# Altium project Mako DSP.PrjPCB
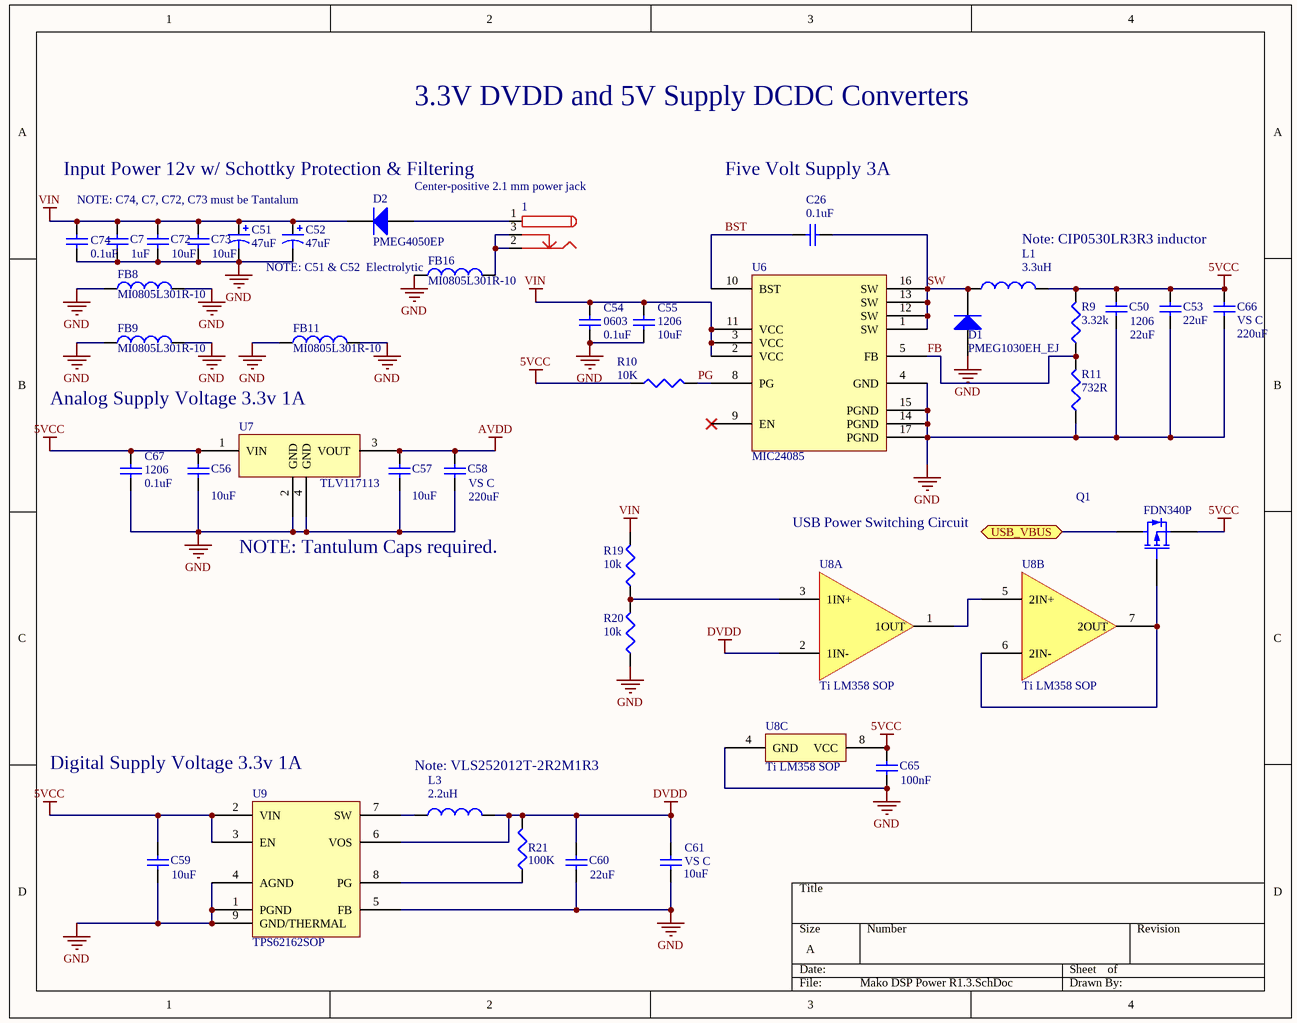
[diagram p0: Mako DSP Power R1.3.SchDoc]
4 sheets, 169 parts. Net scope: flat (ports and power ports of the same name join across sheets).
Board file: Mako DSP R1.6.PcbDoc
Sheets:
  Mako DSP Power R1.3.SchDoc
  Mako DSP Audio Codec R1.2.SchDoc
  Mako DSP Main R1.2.SchDoc
  Mako DSP USBR1.2.SchDoc

## Sheet Mako DSP Power R1.3.SchDoc
size A

### Parts
1  Center-positive 2.1 mm power jack  [PJ-102AH]
C7  value 1uF  [C1206]  (hidden comment: Cap Semi)
C26  value 0.1uF  [1608[0603]]  (hidden comment: Cap Semi)
C50  1206  value 22uF  [C1206]
C51  value 47uF  [CAPPR2.5-6.3x5]  (hidden comment: Cap Pol1)
C52  value 47uF  [CAPPR2.5-6.3x5]  (hidden comment: Cap Pol1)
C53  value 22uF  [C1206]  (hidden comment: Cap Semi)
C54  0603  value 0.1uF  [1608[0603]]
C55  1206  value 10uF  [C1206]
C56  value 10uF  [C1206]  (hidden comment: Cap Semi)
C57  value 10uF  [C1206]  (hidden comment: Cap Semi)
C58  VS C  value 220uF  [Panasonic VS C]
C59  value 10uF  [C1206]  (hidden comment: Cap Semi)
C60  value 22uF  [C1206]  (hidden comment: Cap Semi)
C61  VS C  value 10uF  [Panasonic VS C]
C65  value 100nF  [1608[0603]]  (hidden comment: Cap Semi)
C66  VS C  value 220uF  [Panasonic VS C]
C67  1206  value 0.1uF  [C1206]
C72  value 10uF  [C1206]  (hidden comment: Cap Semi)
C73  value 10uF  [C1206]  (hidden comment: Cap Semi)
C74  value 0.1uF  [C1206]  (hidden comment: Cap Semi)
D1  PMEG1030EH_EJ  [PMEG1030EH_EJ]
D2  PMEG4050EP  [PMEG4050EP]
FB8  MI0805L301R-10  [SM 0805 - gap trimmed]
FB9  MI0805L301R-10  [SM 0805 - gap trimmed]
FB11  MI0805L301R-10  [SM 0805 - gap trimmed]
FB16  MI0805L301R-10  [SM 0805 - gap trimmed]
L1  value 3.3uH  [CIP0530LR3R3]  (hidden comment: Inductor)
L3  value 2.2uH  [VLS252012T-2R2M1R3]  (hidden comment: Inductor)
Q1  FDN340P  [SOT23-3N]
R9  value 3.32k  [J1-0603]  (hidden comment: Res3)
R10  value 10K  [J1-0603]  (hidden comment: Res3)
R11  value 732R  [J1-0603]  (hidden comment: Res3)
R19  value 10k  [J1-0603]  (hidden comment: Res3)
R20  value 10k  [J1-0603]  (hidden comment: Res3)
R21  value 100K  [RESC2012L]  (hidden comment: Res3)
U6  MIC24085  [MIC24085-AYML]
U7  TLV117113  [TLV117112]
U8  Ti LM358 SOP  [LM358]  (parts A,B,C of 3)
U9  TPS62162SOP  [TPS62162SOP]

### Ports
USB_VBUS (bidir)

### Nets
5VCC: C50.2 C53.1 C56.1 C59.2 C65.1 C66.2 C67.2 L1.2 Q1.2(D) R9.2 R10.1 U7.1(VIN) U8.8(VCC) U9.2(VIN) U9.3(EN)
AVDD: C57.1 C58.1 U7.3(VOUT)
DVDD: C60.2 C61.1 L3.2 R21.2 U8.2(1IN-) U9.6(VOS)
GND: C7.1 C50.1 C51.2 C52.2 C53.2 C54.1 C55.1 C56.2 C57.2 C58.2 C59.1 C60.1 C61.2 C65.2 C66.1 C67.1 C72.1 C73.1 C74.1 D1.1(A) FB8.1 FB8.2 FB9.1 FB9.2 FB11.1 FB11.2 FB16.1 R11.1 R20.1 U6.4(GND) U6.14(PGND) U6.15(PGND) U6.17(PGND) U7.2(GND) U7.4(GND) U8.4(GND) U9.1(PGND) U9.4(AGND) U9.5(FB) U9.9(GND/THERMAL)
VIN: C7.2 C51.1 C52.1 C54.2 C55.2 C72.2 C73.2 C74.2 D2.1(A) R19.2 U6.2(VCC) U6.3(VCC) U6.11(VCC)
BST: C26.2 U6.10(BST)
FB: R9.1 R11.2 U6.5(FB)
PG: R10.2 U6.8(PG)
SW: C26.1 D1.2(K) L1.1 U6.1(SW) U6.12(SW) U6.13(SW) U6.16(SW)
Net1_1: 1.1 D2.2(K)
Net1_2: 1.2 1.3 FB16.2
NetFB7_2: Q1.3(S) ; port USB_VBUS
NetL3_1: L3.1 U9.7(SW)
NetQ1_1: Q1.1(G) U8.6(2IN-) U8.7(2OUT)
NetR19_1: R19.1 R20.2 U8.3(1IN+)
NetR21_1: R21.1 U9.8(PG)
NetU8_1: U8.1(1OUT) U8.5(2IN+)

Not connected (* = marked no-connect by the designer): U6 6(NC) 7(NC) 9(EN)*

### Notes on the sheet
- 3.3V DVDD and 5V Supply DCDC Converters
- Input Power 12v w/ Schottky Protection & Filtering
- NOTE: C74, C7, C72, C73 must be Tantalum
- Five Volt Supply 3A
- (near FB16) NOTE: C51 & C52  Electrolytic
- Note: CIP0530LR3R3 inductor
- Analog Supply Voltage 3.3v 1A
- NOTE: Tantulum Caps required.
- USB Power Switching Circuit
- (near U9) Digital Supply Voltage 3.3v 1A
- Note: VLS252012T-2R2M1R3

### Library data of the parts
1 = PWR2.5: Power jack; Published: 17-Dec-2003; DatasheetDocument: 09-May-2002; Publisher: Altium Limited; ComponentLink1Description: Manufacturer Link; ComponentLink1URL: http://domino.kycon.com/internet/Products.html
C7 C26 C50 C53-C61 C65-C67 C72-C74 = Cap Semi: Capacitor (Semiconductor SIM Model); Published: 8-Jun-2000; LatestRevisionDate: 29-May-2009; LatestRevisionNote: IPC-7351 Footprint Added.; PackageReference: C1206; Publisher: Altium Limited; PackageDescription: Chip Capacitor
C51 C52 = Cap Pol1: Polarized Capacitor (Radial); Published: 8-Jun-2000; LatestRevisionDate: 17-Jul-2002; LatestRevisionNote: Re-released for DXP Platform.; PackageReference: RB7.6-15; Publisher: Altium Limited; PackageDescription: Polarized Capacitor (Radial); 2 Leads
D1 D2 = Diode: Default Diode; Published: 8-Jun-2000; LatestRevisionDate: 17-Jul-2002; LatestRevisionNote: Re-released for DXP Platform.; PackageVersion: Sep-1996; PackageReference: SMC; Publisher: Altium Limited; PackageDescription: DO-214-AB/SMC; 2 C-Bend Leads; Body 7.9 x 5.9 mm, inc. leads (LxW); Code_JEDEC: DO-214-AB
FB8 FB9 FB11 FB16 L1 L3 = Inductor: Code_IEC: 1005; Published: 8-Jun-2000; PackageReference: 0402-A; Publisher: Altium Limited; Code_JEITA: 0402
  FB8 FB9 FB11 FB16: LatestRevisionDate: 17-Jul-2002; LatestRevisionNote: Re-released for DXP Platform.
  L1 L3: LatestRevisionDate: 29-May-2009; LatestRevisionNote: IPC-7351 Footprint Added.; PackageDescription: Chip Inductor
Q1 = FDN340P: P-Channel MOSFET; Published: 8-Jun-2000; LatestRevisionDate: 17-Jul-2002; LatestRevisionNote: Re-released for DXP Platform.; PackageVersion: 1995/1996; PackageReference: E3; Publisher: Altium Limited; PackageDescription: TO, Flat Index; 3 In-Line, Axial Leads; Body Dia. 4.6mm; Lead Dia. 0.5 mm (max)
R9-R11 R19-R21 = Res3: Resistor; Published: 8-Jun-2000; LatestRevisionDate: 29-May-2009; LatestRevisionNote: IPC-7351 Footprint Added.; PackageReference: J1-0603; Publisher: Altium Limited; PackageDescription: Chip Resistor
U7 = TLV117112: Linear Regulator
U8 = LM358_Symbol

## Sheet Mako DSP Audio Codec R1.2.SchDoc
size B
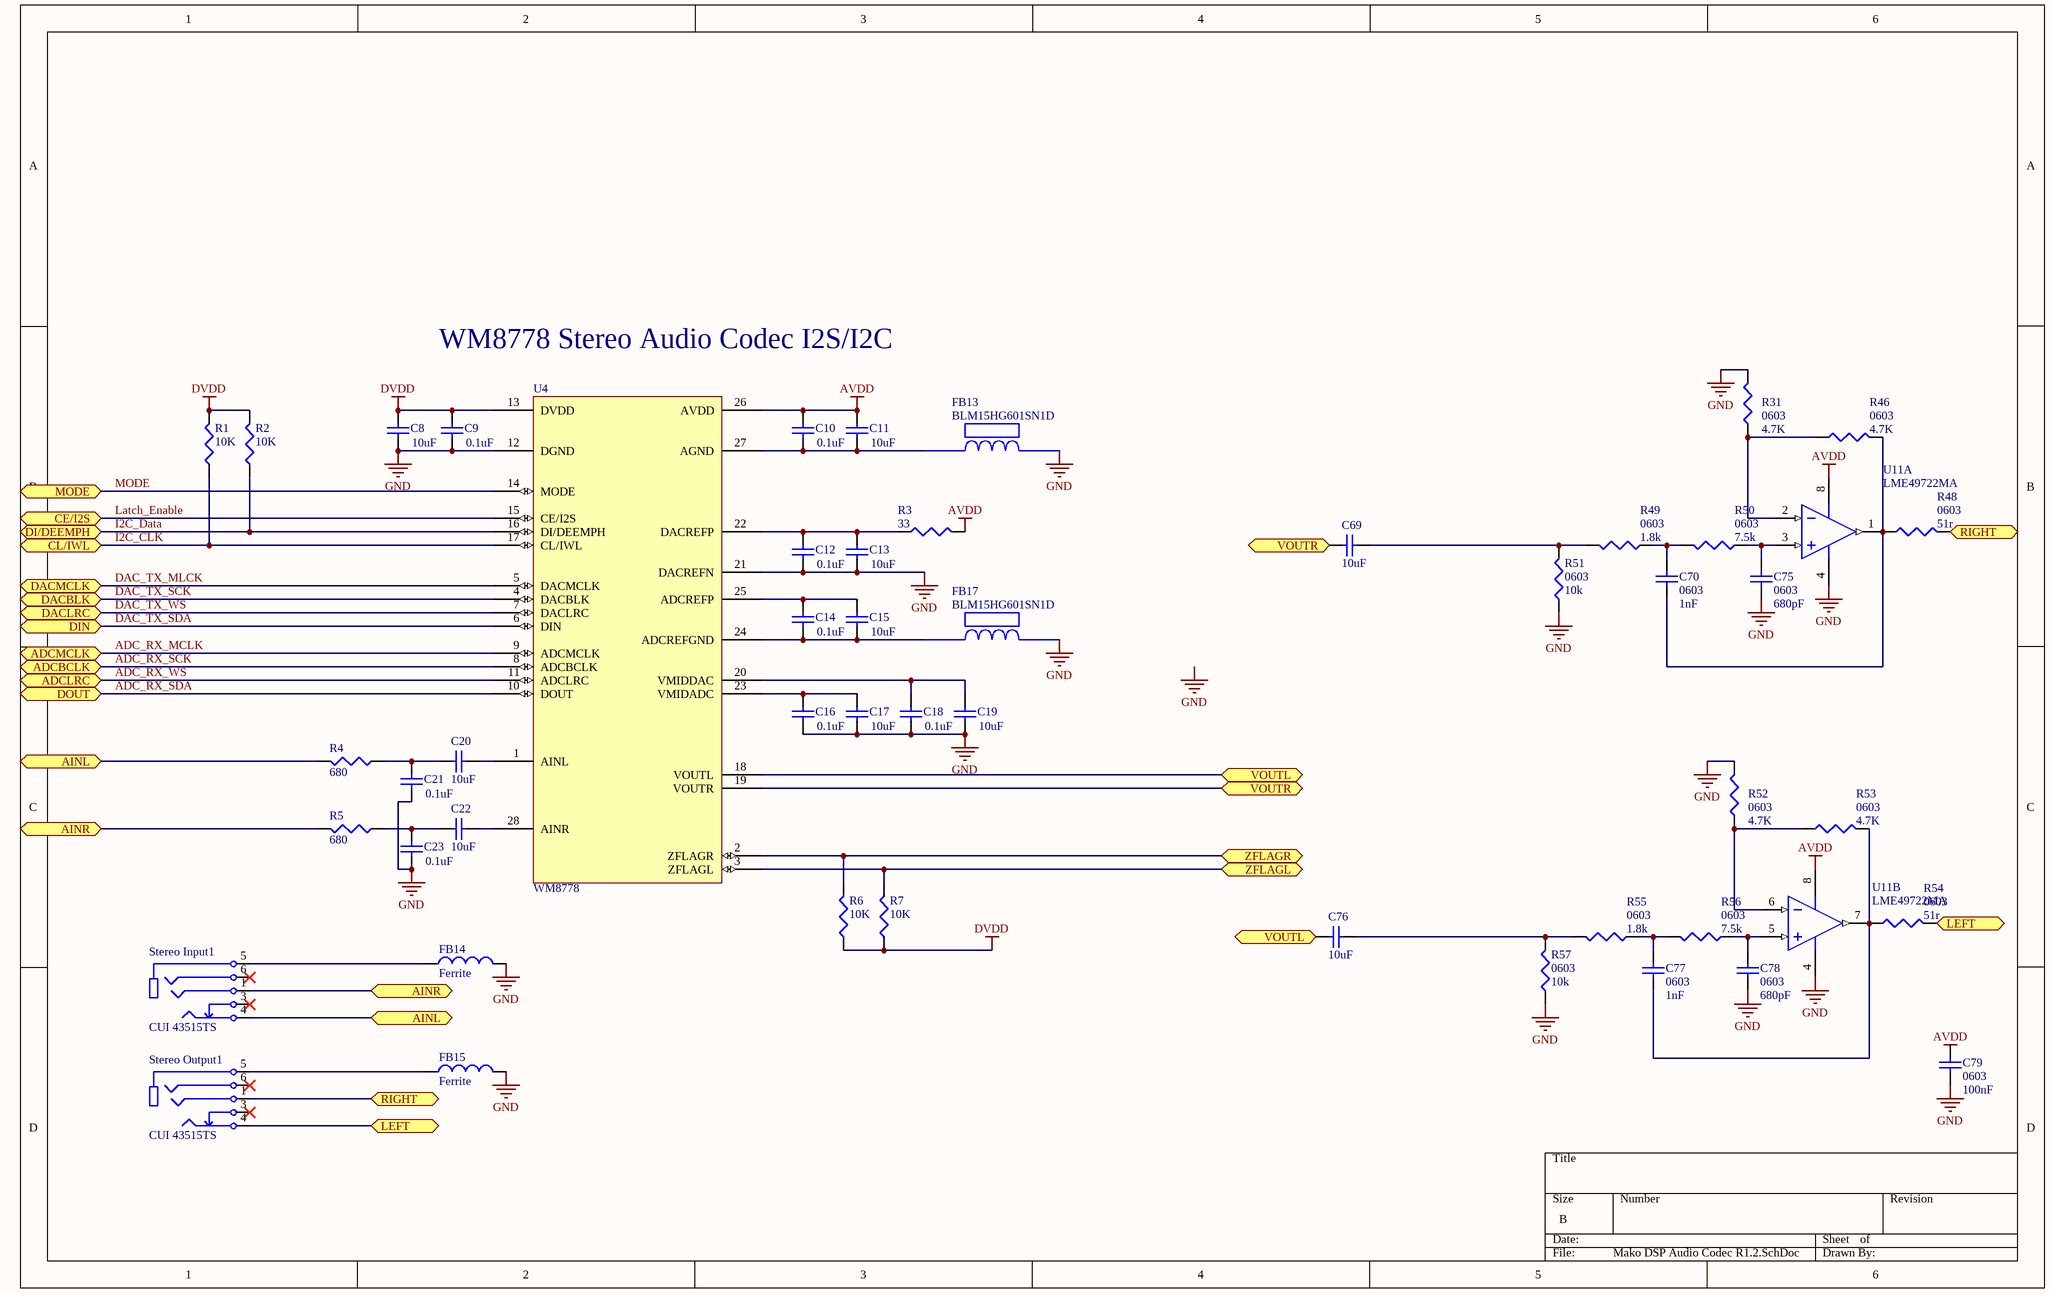
[diagram p1: Mako DSP Audio Codec R1.2.SchDoc]

### Parts
C8  value 10uF  [1608[0603]]  (hidden comment: Cap Semi)
C9  value 0.1uF  [1608[0603]]  (hidden comment: Cap Semi)
C10  value 0.1uF  [1608[0603]]  (hidden comment: Cap Semi)
C11  value 10uF  [1608[0603]]  (hidden comment: Cap Semi)
C12  value 0.1uF  [1608[0603]]  (hidden comment: Cap Semi)
C13  value 10uF  [1608[0603]]  (hidden comment: Cap Semi)
C14  value 0.1uF  [1608[0603]]  (hidden comment: Cap Semi)
C15  value 10uF  [1608[0603]]  (hidden comment: Cap Semi)
C16  value 0.1uF  [1608[0603]]  (hidden comment: Cap Semi)
C17  value 10uF  [1608[0603]]  (hidden comment: Cap Semi)
C18  value 0.1uF  [1608[0603]]  (hidden comment: Cap Semi)
C19  value 10uF  [1608[0603]]  (hidden comment: Cap Semi)
C20  value 10uF  [Panasonic VS B]  (hidden comment: Cap Semi)
C21  value 0.1uF  [SM 0805 - gap trimmed]  (hidden comment: Cap Semi)
C22  value 10uF  [Panasonic VS B]  (hidden comment: Cap Semi)
C23  value 0.1uF  [SM 0805 - gap trimmed]  (hidden comment: Cap Semi)
C69  value 10uF  [Panasonic VS B]  (hidden comment: Cap Semi)
C70  0603  value 1nF  [1608[0603]]
C75  0603  value 680pF  [1608[0603]]
C76  value 10uF  [Panasonic VS B]  (hidden comment: Cap Semi)
C77  0603  value 1nF  [1608[0603]]
C78  0603  value 680pF  [1608[0603]]
C79  0603  value 100nF  [1608[0603]]
FB13  BLM15HG601SN1D  [BLM18PG121SN1D]
FB14  Ferrite  [SM 0805 - gap trimmed]
FB15  Ferrite  [SM 0805 - gap trimmed]
FB17  BLM15HG601SN1D  [BLM18PG121SN1D]
R1  value 10K  [J1-0603]  (hidden comment: Res3)
R2  value 10K  [J1-0603]  (hidden comment: Res3)
R3  value 33  [J1-0603]  (hidden comment: Res3)
R4  value 680  [SM 0805 - gap trimmed]  (hidden comment: Res3)
R5  value 680  [SM 0805 - gap trimmed]  (hidden comment: Res3)
R6  value 10K  [J1-0603]  (hidden comment: Res3)
R7  value 10K  [J1-0603]  (hidden comment: Res3)
R31  0603  value 4.7K  [J1-0603]
R46  0603  value 4.7K  [J1-0603]
R48  0603  value 51r  [J1-0603]
R49  0603  value 1.8k  [J1-0603]
R50  0603  value 7.5k  [J1-0603]
R51  0603  value 10k  [J1-0603]
R52  0603  value 4.7K  [J1-0603]
R53  0603  value 4.7K  [J1-0603]
R54  0603  value 51r  [J1-0603]
R55  0603  value 1.8k  [J1-0603]
R56  0603  value 7.5k  [J1-0603]
R57  0603  value 10k  [J1-0603]
Stereo_Input1  CUI 43515TS  [CUI SJ-43515TS]
Stereo_Output1  CUI 43515TS  [CUI SJ-43515TS]
U4  WM8778  [WM8778]
U11  LME49722MA  [M08A_N]  (parts A,B of 2)

### Ports
ADCBCLK (bidir), ADCLRC (bidir), ADCMCLK (bidir), AINL, AINR, CE/I2S (bidir), CL/IWL (bidir), DACBLK (bidir), DACLRC (bidir), DACMCLK (bidir), DI/DEEMPH (bidir), DIN (bidir), DOUT (bidir), LEFT, MODE (bidir), RIGHT, VOUTL, VOUTR, ZFLAGL (bidir), ZFLAGR (bidir)

### Nets
AVDD: C10.2 C11.2 R3.2 U4.26(AVDD) U11.8(V+)
DVDD: C8.2 C9.2 R1.2 R2.2 R6.1 R7.1 U4.13(DVDD)
GND: C8.1 C9.1 C12.1 C13.1 C16.1 C17.1 C18.1 C19.1 C21.1 C23.1 C75.1 C78.1 C79.1 FB13.2 FB14.2 FB15.2 FB17.2 R31.2 R51.1 R52.2 R57.1 U4.12(DGND) U4.21(DACREFN) U11.4(V-)
ADC_RX_MCLK: U4.9(ADCMCLK) ; port ADCMCLK
ADC_RX_SCK: U4.8(ADCBCLK) ; port ADCBCLK
ADC_RX_SDA: U4.10(DOUT) ; port DOUT
ADC_RX_WS: U4.11(ADCLRC) ; port ADCLRC
DAC_TX_MLCK: U4.5(DACMCLK) ; port DACMCLK
DAC_TX_SCK: U4.4(DACBLK) ; port DACBLK
DAC_TX_SDA: U4.6(DIN) ; port DIN
DAC_TX_WS: U4.7(DACLRC) ; port DACLRC
I2C_CLK: R1.1 U4.17(CL/IWL) ; port CL/IWL
I2C_Data: R2.1 U4.16(DI/DEEMPH) ; port DI/DEEMPH
Latch_Enable: U4.15(CE/I2S) ; port CE/I2S
MODE: U4.14(MODE) ; port MODE
NetC10_1: C10.1 C11.1 FB13.1 U4.27(AGND)
NetC12_2: C12.2 C13.2 R3.1 U4.22(DACREFP)
NetC14_1: C14.1 C15.1 FB17.1 U4.24(ADCREFGND)
NetC14_2: C14.2 C15.2 U4.25(ADCREFP)
NetC16_2: C16.2 C17.2 U4.23(VMIDADC)
NetC18_2: C18.2 C19.2 U4.20(VMIDDAC)
NetC20_1: C20.1 U4.1(AINL)
NetC20_2: C20.2 C21.2 R4.1
NetC22_1: C22.1 U4.28(AINR)
NetC22_2: C22.2 C23.2 R5.1
NetC69_1: C69.1 U4.19(VOUTR) ; port VOUTR
NetC69_2: C69.2 R49.2 R51.2
NetC70_1: C70.1 R46.2 R48.1 U11.1(OUT_A)
NetC70_2: C70.2 R49.1 R50.2
NetC75_2: C75.2 R50.1 U11.3(IN_A)
NetC76_1: C76.1 U4.18(VOUTL) ; port VOUTL
NetC76_2: C76.2 R55.2 R57.2
NetC77_1: C77.1 R53.2 R54.1 U11.7(OUT_B)
NetC77_2: C77.2 R55.1 R56.2
NetC78_2: C78.2 R56.1 U11.5(IN_B)
NetFB14_1: FB14.1 Stereo_Input1.5(SLEEVE)
NetFB15_1: FB15.1 Stereo_Output1.5(SLEEVE)
NetR4_2: R4.2 Stereo_Input1.4(TIP) ; port AINL
NetR5_2: R5.2 Stereo_Input1.1(R1) ; port AINR
NetR6_2: R6.2 U4.2(ZFLAGR) ; port ZFLAGR
NetR7_2: R7.2 U4.3(ZFLAGL) ; port ZFLAGL
NetR31_1: R31.1 R46.1 U11.2(IN_A)
NetR48_2: R48.2 Stereo_Output1.1(R1) ; port RIGHT
NetR52_1: R52.1 R53.1 U11.6(IN_B)
NetR54_2: R54.2 Stereo_Output1.4(TIP) ; port LEFT

Not connected (* = marked no-connect by the designer): C79 2; Stereo_Input1 3(TS)* 6(R2)*; Stereo_Output1 3(TS)* 6(R2)*

### Notes on the sheet
- WM8778 Stereo Audio Codec I2S/I2C
- Labels drawn without touching a wire or pin: AVDD, GND

### Library data of the parts
C8-C23 C69 C70 C75-C79 = Cap Semi: Capacitor (Semiconductor SIM Model); Published: 8-Jun-2000; LatestRevisionDate: 29-May-2009; LatestRevisionNote: IPC-7351 Footprint Added.; PackageReference: C1206; Publisher: Altium Limited; PackageDescription: Chip Capacitor
FB14 FB15 = Inductor: Code_IEC: 1005; Published: 8-Jun-2000; LatestRevisionDate: 17-Jul-2002; LatestRevisionNote: Re-released for DXP Platform.; PackageReference: 0402-A; Publisher: Altium Limited; Code_JEITA: 0402
R1-R7 R31 R46 R48-R57 = Res3: Resistor; Published: 8-Jun-2000; LatestRevisionDate: 29-May-2009; LatestRevisionNote: IPC-7351 Footprint Added.; PackageReference: J1-0603; Publisher: Altium Limited; PackageDescription: Chip Resistor
U11 = LME49722MA: Low Noise, High Performance, High Fidelity Dual Audio Operational Amplifier, 8-pin Narrow SOIC; Manufacturer: National Semiconductor; PackageTopMarking: NSZXTT*L49722*MA; PowerWise: N; CompType: Audio IC; High-Reliability: Y; DatasheetVersion: Mar-2008; PackageVersion: revM, May-2009; PackageReference: M08A; PackageDescription: SOIC Narrow, 4.9 x 3.9 x 1.45mm, 8 Lead, 1.27mm Pitch; PartNumber: LME49722MA; RoHS: Y; PinCount: 8; Code_JEDEC: MS-012-AA; Code_IPC: SOIC127P600-8; ComponentLink1Description: Manufacturer URL; ComponentLink1URL: http://www.national.com/; ComponentLink2Description: LME49722 Datasheet; ComponentLink2URL: http://www.national.com/ds/LM/LME49722.pdf; ComponentLink3Description: LME49722 Web Page; ComponentLink3URL: http://www.national.com/pf/LM/LME49722.html; ComponentLink4Description: M08A Package Page; ComponentLink4URL: http://www.national.com/packaging/folders/m08a.html

## Sheet Mako DSP Main R1.2.SchDoc
size B
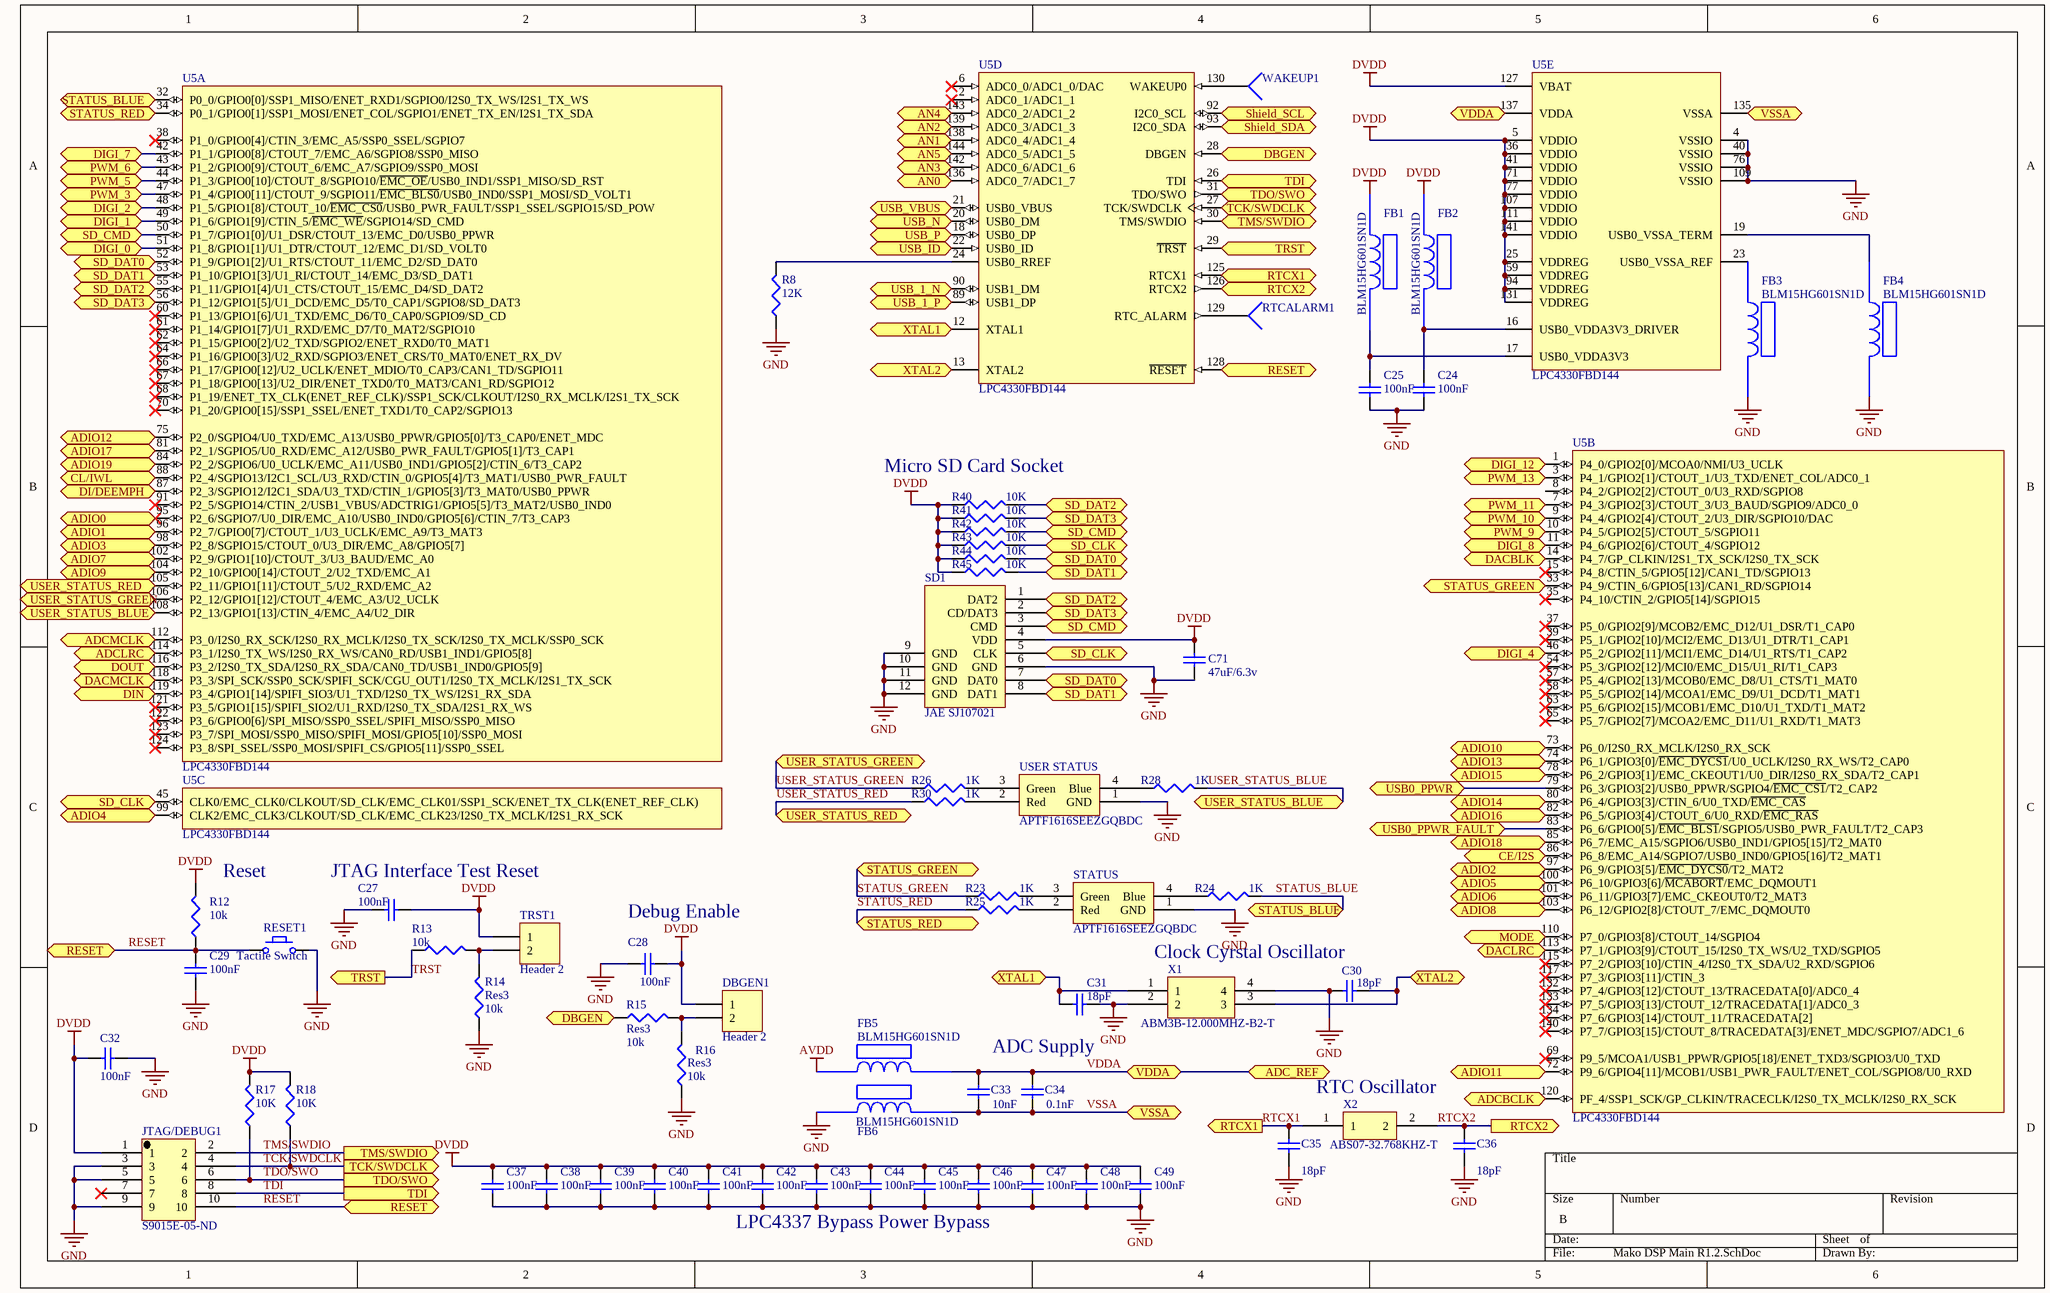
[diagram p2: Mako DSP Main R1.2.SchDoc]

### Parts
C24  value 100nF  [0402]  (hidden comment: Cap Semi)
C25  value 100nF  [0402]  (hidden comment: Cap Semi)
C27  C1: 100nF  [CAPC1608L]  (hidden comment: Cap Semi)
C28  C1: 100nF  [CAPC1608L]  (hidden comment: Cap Semi)
C29  C1: 100nF  [CAPC1608L]  (hidden comment: Cap Semi)
C30  value 18pF  [1608[0603]]  (hidden comment: Cap Semi)
C31  value 18pF  [1608[0603]]  (hidden comment: Cap Semi)
C32  C1: 100nF  [CAPC1608L]  (hidden comment: Cap Semi)
C33  value 10nF  [1608[0603]]  (hidden comment: Cap Semi)
C34  value 0.1nF  [1608[0603]]  (hidden comment: Cap Semi)
C35  value 18pF  [1608[0603]]  (hidden comment: Cap Semi)
C36  value 18pF  [1608[0603]]  (hidden comment: Cap Semi)
C37  value 100nF  [1608[0603]]  (hidden comment: Cap Semi)
C38  value 100nF  [1608[0603]]  (hidden comment: Cap Semi)
C39  value 100nF  [1608[0603]]  (hidden comment: Cap Semi)
C40  value 100nF  [1608[0603]]  (hidden comment: Cap Semi)
C41  value 100nF  [1608[0603]]  (hidden comment: Cap Semi)
C42  value 100nF  [1608[0603]]  (hidden comment: Cap Semi)
C43  value 100nF  [1608[0603]]  (hidden comment: Cap Semi)
C44  value 100nF  [1608[0603]]  (hidden comment: Cap Semi)
C45  value 100nF  [1608[0603]]  (hidden comment: Cap Semi)
C46  value 100nF  [1608[0603]]  (hidden comment: Cap Semi)
C47  value 100nF  [1608[0603]]  (hidden comment: Cap Semi)
C48  value 100nF  [1608[0603]]  (hidden comment: Cap Semi)
C49  value 100nF  [1608[0603]]  (hidden comment: Cap Semi)
C71  value 47uF/6.3v  [Panasonic VS B]  (hidden comment: Cap Semi)
DBGEN1  Header 2  [HDR1X2]
FB1  BLM15HG601SN1D  [BLM18PG121SN1D]
FB2  BLM15HG601SN1D  [BLM18PG121SN1D]
FB3  BLM15HG601SN1D  [BLM18PG121SN1D]
FB4  BLM15HG601SN1D  [BLM18PG121SN1D]
FB5  BLM15HG601SN1D  [BLM18PG121SN1D]
FB6  BLM15HG601SN1D  [BLM18PG121SN1D]
JTAG/DEBUG1  S9015E-05-ND  [S9015E-05-ND]
R8  value 12K  [J1-0603]  (hidden comment: Res3)
R12  value 10k  [J1-0603]  (hidden comment: Res3)
R13  value 10k  [J1-0603]  (hidden comment: Res3)
R14  Res3  value 10k  [J1-0603]
R15  Res3  value 10k  [J1-0603]
R16  Res3  value 10k  [J1-0603]
R17  value 10K  [J1-0603]  (hidden comment: Res3)
R18  value 10K  [J1-0603]  (hidden comment: Res3)
R23  value 1K  [J1-0603]  (hidden comment: Res3)
R24  value 1K  [J1-0603]  (hidden comment: Res3)
R25  value 1K  [J1-0603]  (hidden comment: Res3)
R26  value 1K  [J1-0603]  (hidden comment: Res3)
R28  value 1K  [J1-0603]  (hidden comment: Res3)
R30  value 1K  [J1-0603]  (hidden comment: Res3)
R40  value 10K  [J1-0603]  (hidden comment: Res3)
R41  value 10K  [J1-0603]  (hidden comment: Res3)
R42  value 10K  [J1-0603]  (hidden comment: Res3)
R43  value 10K  [J1-0603]  (hidden comment: Res3)
R44  value 10K  [J1-0603]  (hidden comment: Res3)
R45  value 10K  [J1-0603]  (hidden comment: Res3)
RESET1  Tactile Switch  [TL3301]
RTCALARM1  Socket  [PIN1]  (value not drawn)
SD1  JAE SJ107021  [JAE SJ107021]
STATUS  APTF1616SEEZGQBDC  [RGB LED APTF1616SEEZGQBDC]
TRST1  Header 2  [HDR1X2]
U5  LPC4330FBD144  [SOT486-1_V]  (parts A,B,C,D,E of 5)
USER_STATUS  APTF1616SEEZGQBDC  [RGB LED APTF1616SEEZGQBDC]
WAKEUP1  Socket  [PIN1]  (value not drawn)
X1  ABM3B-12.000MHZ-B2-T  [ABM3B-12.000MHZ-B2-T]
X2  ABS07-32.768KHZ-T  [ABS07-32.768KHZ-T]

### Ports
ADC_REF, ADCBCLK (bidir), ADCLRC (bidir), ADCMCLK (bidir), ADIO0 (bidir), ADIO1 (bidir), ADIO2 (bidir), ADIO3 (bidir), ADIO4, ADIO5 (bidir), ADIO6 (bidir), ADIO7, ADIO8 (bidir), ADIO9, ADIO10 (bidir), ADIO11 (bidir), ADIO12 (bidir), ADIO13 (bidir), ADIO14 (bidir), ADIO15 (bidir), ADIO16 (bidir), ADIO17 (bidir), ADIO18 (bidir), ADIO19 (bidir), AN0 (bidir), AN1 (bidir), AN2 (bidir), AN3 (bidir), AN4 (bidir), AN5 (bidir), CE/I2S (bidir), CL/IWL (bidir), DACBLK (bidir), DACLRC (bidir), DACMCLK (bidir), DBGEN (in), DBGEN (out), DI/DEEMPH (bidir), DIGI_0 (bidir), DIGI_1 (bidir), DIGI_2 (bidir), DIGI_4 (bidir), DIGI_7 (bidir), DIGI_8 (bidir), DIGI_12 (bidir), DIN (bidir), DOUT (bidir), MODE (bidir), PWM_3 (bidir), PWM_5 (bidir), PWM_6 (bidir), PWM_9 (bidir), PWM_10 (bidir), PWM_11 (bidir), PWM_13 (bidir), RESET (bidir), RTCX1 (in), RTCX1 (out), RTCX2 (out), SD_CLK (bidir), SD_CMD (bidir), SD_DAT0 (bidir), SD_DAT1 (bidir), SD_DAT2 (bidir), SD_DAT3 (bidir), Shield_SCL (bidir), Shield_SDA (bidir), STATUS_BLUE (bidir), STATUS_GREEN (bidir), STATUS_RED (bidir), TCK/SWDCLK (in), TCK/SWDCLK (out), TDI (in), TDI (out), TDO/SWO (out), TMS/SWDIO (in), TMS/SWDIO (out), TRST (in), TRST (out), USB0_PPWR (bidir), USB0_PPWR_FAULT (bidir), USB_1_N (bidir), USB_1_P (bidir), USB_ID (bidir), USB_N (bidir), USB_P (bidir), USB_VBUS (bidir), USER_STATUS_BLUE (bidir), USER_STATUS_GREEN (bidir), USER_STATUS_RED (bidir), VDDA, VSSA, XTAL1 (bidir), XTAL2 (bidir)

### Nets
AVDD: FB5.1
DVDD: C27.2 C28.2 C32.1 C37.2 C38.2 C39.2 C40.2 C41.2 C42.2 C43.2 C44.2 C45.2 C46.2 C47.2 C48.2 C49.2 C71.2 DBGEN1.1 FB1.1 FB2.1 JTAG/DEBUG1.1 R12.2 R17.2 R18.2 R40.1 R41.1 R42.1 R43.1 R44.1 R45.1 SD1.4(VDD) TRST1.1 U5.5(VDDIO) U5.25(VDDREG) U5.36(VDDIO) U5.41(VDDIO) U5.59(VDDREG) U5.71(VDDIO) U5.77(VDDIO) U5.94(VDDREG) U5.107(VDDIO) U5.111(VDDIO) U5.127(VBAT) U5.131(VDDREG) U5.141(VDDIO)
GND: C24.1 C25.1 C27.1 C28.1 C29.1 C30.2 C31.1 C32.2 C35.1 C36.1 C37.1 C38.1 C39.1 C40.1 C41.1 C42.1 C43.1 C44.1 C45.1 C46.1 C47.1 C48.1 C49.1 C71.1 FB3.2 FB4.2 FB6.1 JTAG/DEBUG1.3 JTAG/DEBUG1.5 JTAG/DEBUG1.9 R8.1 R14.1 R16.1 RESET1.2 SD1.6(GND) SD1.9(GND) SD1.10(GND) SD1.11(GND) SD1.12(GND) STATUS.1(GND) U5.4(VSSIO) U5.40(VSSIO) U5.76(VSSIO) U5.109(VSSIO) USER_STATUS.1(GND) X1.2 X1.4
ADC_RX_MCLK: U5.112(P3_0/I2S0_RX_SCK/I2S0_RX_MCLK/I2S0_TX_SCK/I2S0_TX_MCLK/SSP0_SCK) ; port ADCMCLK
ADC_RX_SCK: U5.120(PF_4/SSP1_SCK/GP_CLKIN/TRACECLK/I2S0_TX_MCLK/I2S0_RX_SCK) ; port ADCBCLK
ADC_RX_SDA: U5.116(P3_2/I2S0_TX_SDA/I2S0_RX_SDA/CAN0_TD/USB1_IND0/GPIO5[9]) ; port DOUT
ADC_RX_WS: U5.114(P3_1/I2S0_TX_WS/I2S0_RX_WS/CAN0_RD/USB1_IND1/GPIO5[8]) ; port ADCLRC
DAC_TX_MLCK: U5.118(P3_3/SPI_SCK/SSP0_SCK/SPIFI_SCK/CGU_OUT1/I2S0_TX_MCLK/I2S1_TX_SCK) ; port DACMCLK
DAC_TX_SCK: U5.14(P4_7/GP_CLKIN/I2S1_TX_SCK/I2S0_TX_SCK) ; port DACBLK
DAC_TX_SDA: U5.119(P3_4/GPIO1[14]/SPIFI_SIO3/U1_TXD/I2S0_TX_WS/I2S1_RX_SDA) ; port DIN
DAC_TX_WS: U5.113(P7_1/GPIO3[9]/CTOUT_15/I2S0_TX_WS/U2_TXD/SGPIO5) ; port DACLRC
I2C_CLK: U5.88(P2_4/SGPIO13/I2C1_SCL/U3_RXD/CTIN_0/GPIO5[4]/T3_MAT1/USB0_PWR_FAULT) ; port CL/IWL
I2C_Data: U5.87(P2_3/SGPIO12/I2C1_SDA/U3_TXD/CTIN_1/GPIO5[3]/T3_MAT0/USB0_PPWR) ; port DI/DEEMPH
Latch_Enable: U5.86(P6_8/EMC_A14/SGPIO7/USB0_IND0/GPIO5[16]/T2_MAT1) ; port CE/I2S
MODE: U5.110(P7_0/GPIO3[8]/CTOUT_14/SGPIO4) ; port MODE
RESET: C29.2 JTAG/DEBUG1.10 R12.1 RESET1.1 U5.128(~{RESET}) ; port RESET
RTCX1: C35.2 U5.125(RTCX1) X2.1 ; port RTCX1
RTCX2: C36.2 U5.126(RTCX2) X2.2 ; port RTCX2
STATUS_BLUE: R24.2 U5.32(P0_0/GPIO0[0]/SSP1_MISO/ENET_RXD1/SGPIO0/I2S0_TX_WS/I2S1_TX_WS) ; port STATUS_BLUE
STATUS_GREEN: R23.1 U5.33(P4_9/CTIN_6/GPIO5[13]/CAN1_RD/SGPIO14) ; port STATUS_GREEN
STATUS_RED: R25.1 U5.34(P0_1/GPIO0[1]/SSP1_MOSI/ENET_COL/SGPIO1/ENET_TX_EN/I2S1_TX_SDA) ; port STATUS_RED
TCK/SWDCLK: JTAG/DEBUG1.4 R18.1 U5.27(TCK/SWDCLK) ; port TCK/SWDCLK
TDI: JTAG/DEBUG1.8 U5.26(TDI) ; port TDI
TDO/SWO: JTAG/DEBUG1.6 R17.1 U5.31(TDO/SWO) ; port TDO/SWO
TMS/SWDIO: JTAG/DEBUG1.2 U5.30(TMS/SWDIO) ; port TMS/SWDIO
TRST: R13.1 U5.29(~{TRST}) ; port TRST
USB0_N: U5.20(USB0_DM) ; port USB_N
USB0_P: U5.18(USB0_DP) ; port USB_P
USB0_PPWR: U5.79(P6_3/GPIO3[2]/USB0_PPWR/SGPIO4/~{EMC_CS1}/T2_CAP2) ; port USB0_PPWR
USB0_PPWR_FAULT: U5.83(P6_6/GPIO0[5]/~{EMC_BLS1}/SGPIO5/USB0_PWR_FAULT/T2_CAP3) ; port USB0_PPWR_FAULT
USER_STATUS_BLUE: R28.2 U5.108(P2_13/GPIO1[13]/CTIN_4/EMC_A4/U2_DIR) ; port USER_STATUS_BLUE
USER_STATUS_GREEN: R26.1 U5.106(P2_12/GPIO1[12]/CTOUT_4/EMC_A3/U2_UCLK) ; port USER_STATUS_GREEN
USER_STATUS_RED: R30.1 U5.105(P2_11/GPIO1[11]/CTOUT_5/U2_RXD/EMC_A2) ; port USER_STATUS_RED
VDDA: C33.2 C34.2 FB5.2 U5.137(VDDA) ; port VDDA, port ADC_REF
VSSA: C33.1 C34.1 FB6.2 U5.135(VSSA) ; port VSSA
NetC24_2: C24.2 FB2.2 U5.16(USB0_VDDA3V3_DRIVER)
NetC25_2: C25.2 FB1.2 U5.17(USB0_VDDA3V3)
NetC30_1: C30.1 U5.13(XTAL2) X1.3 ; port XTAL2
NetC31_2: C31.2 U5.12(XTAL1) X1.1 ; port XTAL1
NetDBGEN1_2: DBGEN1.2 R15.2 R16.2
NetFB3_1: FB3.1 U5.23(USB0_VSSA_REF)
NetFB4_1: FB4.1 U5.19(USB0_VSSA_TERM)
NetFB7_2: U5.21(USB0_VBUS) ; port USB_VBUS
NetJ3_4: U5.22(USB0_ID) ; port USB_ID
NetR8_2: R8.2 U5.24(USB0_RREF)
NetR13_2: R13.2 R14.2 TRST1.2
NetR15_1: R15.1 U5.28(DBGEN) ; port DBGEN
NetR23_2: R23.2 STATUS.3(Green)
NetR24_1: R24.1 STATUS.4(Blue)
NetR25_2: R25.2 STATUS.2(Red)
NetR26_2: R26.2 USER_STATUS.3(Green)
NetR28_1: R28.1 USER_STATUS.4(Blue)
NetR30_2: R30.2 USER_STATUS.2(Red)
NetR40_2: R40.2 SD1.1(DAT2) U5.55(P1_11/GPIO1[4]/U1_CTS/CTOUT_15/EMC_D4/SD_DAT2) ; port SD_DAT2
NetR41_2: R41.2 SD1.2(CD/DAT3) U5.56(P1_12/GPIO1[5]/U1_DCD/EMC_D5/T0_CAP1/SGPIO8/SD_DAT3) ; port SD_DAT3
NetR42_2: R42.2 SD1.3(CMD) U5.50(P1_7/GPIO1[0]/U1_DSR/CTOUT_13/EMC_D0/USB0_PPWR) ; port SD_CMD
NetR43_2: R43.2 SD1.5(CLK) U5.45(CLK0/EMC_CLK0/CLKOUT/SD_CLK/EMC_CLK01/SSP1_SCK/ENET_TX_CLK(ENET_REF_CLK)) ; port SD_CLK
NetR44_2: R44.2 SD1.7(DAT0) U5.52(P1_9/GPIO1[2]/U1_RTS/CTOUT_11/EMC_D2/SD_DAT0) ; port SD_DAT0
NetR45_2: R45.2 SD1.8(DAT1) U5.53(P1_10/GPIO1[3]/U1_RI/CTOUT_14/EMC_D3/SD_DAT1) ; port SD_DAT1
NetRTCALARM1_1: RTCALARM1.1 U5.129(RTC_ALARM)
NetU5_1: U5.1(P4_0/GPIO2[0]/MCOA0/NMI/U3_UCLK) ; port DIGI_12
NetU5_3: U5.3(P4_1/GPIO2[1]/CTOUT_1/U3_TXD/ENET_COL/ADC0_1) ; port PWM_13
NetU5_7: U5.7(P4_3/GPIO2[3]/CTOUT_3/U3_BAUD/SGPIO9/ADC0_0) ; port PWM_11
NetU5_9: U5.9(P4_4/GPIO2[4]/CTOUT_2/U3_DIR/SGPIO10/DAC) ; port PWM_10
NetU5_10: U5.10(P4_5/GPIO2[5]/CTOUT_5/SGPIO11) ; port PWM_9
NetU5_11: U5.11(P4_6/GPIO2[6]/CTOUT_4/SGPIO12) ; port DIGI_8
NetU5_42: U5.42(P1_1/GPIO0[8]/CTOUT_7/EMC_A6/SGPIO8/SSP0_MISO) ; port DIGI_7
NetU5_43: U5.43(P1_2/GPIO0[9]/CTOUT_6/EMC_A7/SGPIO9/SSP0_MOSI) ; port PWM_6
NetU5_44: U5.44(P1_3/GPIO0[10]/CTOUT_8/SGPIO10/~{EMC_OE}/USB0_IND1/SSP1_MISO/SD_RST) ; port PWM_5
NetU5_46: U5.46(P5_2/GPIO2[11]/MCI1/EMC_D14/U1_RTS/T1_CAP2) ; port DIGI_4
NetU5_47: U5.47(P1_4/GPIO0[11]/CTOUT_9/SGPIO11/~{EMC_BLS0}/USB0_IND0/SSP1_MOSI/SD_VOLT1) ; port PWM_3
NetU5_48: U5.48(P1_5/GPIO1[8]/CTOUT_10/~{EMC_CS0}/USB0_PWR_FAULT/SSP1_SSEL/SGPIO15/SD_POW) ; port DIGI_2
NetU5_49: U5.49(P1_6/GPIO1[9]/CTIN_5/~{EMC_WE}/SGPIO14/SD_CMD) ; port DIGI_1
NetU5_51: U5.51(P1_8/GPIO1[1]/U1_DTR/CTOUT_12/EMC_D1/SD_VOLT0) ; port DIGI_0
NetU5_72: U5.72(P9_6/GPIO4[11]/MCOB1/USB1_PWR_FAULT/ENET_COL/SGPIO8/U0_RXD) ; port ADIO11
NetU5_73: U5.73(P6_0/I2S0_RX_MCLK/I2S0_RX_SCK) ; port ADIO10
NetU5_74: U5.74(P6_1/GPIO3[0]/~{EMC_DYCS1}/U0_UCLK/I2S0_RX_WS/T2_CAP0) ; port ADIO13
NetU5_75: U5.75(P2_0/SGPIO4/U0_TXD/EMC_A13/USB0_PPWR/GPIO5[0]/T3_CAP0/ENET_MDC) ; port ADIO12
NetU5_78: U5.78(P6_2/GPIO3[1]/EMC_CKEOUT1/U0_DIR/I2S0_RX_SDA/T2_CAP1) ; port ADIO15
NetU5_80: U5.80(P6_4/GPIO3[3]/CTIN_6/U0_TXD/~{EMC_CAS}) ; port ADIO14
NetU5_81: U5.81(P2_1/SGPIO5/U0_RXD/EMC_A12/USB0_PWR_FAULT/GPIO5[1]/T3_CAP1) ; port ADIO17
NetU5_82: U5.82(P6_5/GPIO3[4]/CTOUT_6/U0_RXD/~{EMC_RAS}) ; port ADIO16
NetU5_84: U5.84(P2_2/SGPIO6/U0_UCLK/EMC_A11/USB0_IND1/GPIO5[2]/CTIN_6/T3_CAP2) ; port ADIO19
NetU5_85: U5.85(P6_7/EMC_A15/SGPIO6/USB0_IND1/GPIO5[15]/T2_MAT0) ; port ADIO18
NetU5_89: U5.89(USB1_DP) ; port USB_1_P
NetU5_90: U5.90(USB1_DM) ; port USB_1_N
NetU5_92: U5.92(I2C0_SCL) ; port Shield_SCL
NetU5_93: U5.93(I2C0_SDA) ; port Shield_SDA
NetU5_95: U5.95(P2_6/SGPIO7/U0_DIR/EMC_A10/USB0_IND0/GPIO5[6]/CTIN_7/T3_CAP3) ; port ADIO0
NetU5_96: U5.96(P2_7/GPIO0[7]/CTOUT_1/U3_UCLK/EMC_A9/T3_MAT3) ; port ADIO1
NetU5_97: U5.97(P6_9/GPIO3[5]/~{EMC_DYCS0}/T2_MAT2) ; port ADIO2
NetU5_98: U5.98(P2_8/SGPIO15/CTOUT_0/U3_DIR/EMC_A8/GPIO5[7]) ; port ADIO3
NetU5_99: U5.99(CLK2/EMC_CLK3/CLKOUT/SD_CLK/EMC_CLK23/I2S0_TX_MCLK/I2S1_RX_SCK) ; port ADIO4
NetU5_100: U5.100(P6_10/GPIO3[6]/~{MCABORT}/EMC_DQMOUT1) ; port ADIO5
NetU5_101: U5.101(P6_11/GPIO3[7]/EMC_CKEOUT0/T2_MAT3) ; port ADIO6
NetU5_102: U5.102(P2_9/GPIO1[10]/CTOUT_3/U3_BAUD/EMC_A0) ; port ADIO7
NetU5_103: U5.103(P6_12/GPIO2[8]/CTOUT_7/EMC_DQMOUT0) ; port ADIO8
NetU5_104: U5.104(P2_10/GPIO0[14]/CTOUT_2/U2_TXD/EMC_A1) ; port ADIO9
NetU5_130: U5.130(WAKEUP0) WAKEUP1.1
NetU5_136: U5.136(ADC0_7/ADC1_7) ; port AN0
NetU5_138: U5.138(ADC0_4/ADC1_4) ; port AN1
NetU5_139: U5.139(ADC0_3/ADC1_3) ; port AN2
NetU5_142: U5.142(ADC0_6/ADC1_6) ; port AN3
NetU5_143: U5.143(ADC0_2/ADC1_2) ; port AN4
NetU5_144: U5.144(ADC0_5/ADC1_5) ; port AN5

Not connected (* = marked no-connect by the designer): JTAG/DEBUG1 7*; U5 2(ADC0_1/ADC1_1)* 6(ADC0_0/ADC1_0/DAC)* 8(P4_2/GPIO2[2]/CTOUT_0/U3_RXD/SGPIO8) 15(P4_8/CTIN_5/GPIO5[12]/CAN1_TD/SGPIO13)* 35(P4_10/CTIN_2/GPIO5[14]/SGPIO15)* 37(P5_0/GPIO2[9]/MCOB2/EMC_D12/U1_DSR/T1_CAP0)* 38(P1_0/GPIO0[4]/CTIN_3/EMC_A5/SSP0_SSEL/SGPIO7)* 39(P5_1/GPIO2[10]/MCI2/EMC_D13/U1_DTR/T1_CAP1)* 54(P5_3/GPIO2[12]/MCI0/EMC_D15/U1_RI/T1_CAP3)* 57(P5_4/GPIO2[13]/MCOB0/EMC_D8/U1_CTS/T1_MAT0)* 58(P5_5/GPIO2[14]/MCOA1/EMC_D9/U1_DCD/T1_MAT1)* 60(P1_13/GPIO1[6]/U1_TXD/EMC_D6/T0_CAP0/SGPIO9/SD_CD)* 61(P1_14/GPIO1[7]/U1_RXD/EMC_D7/T0_MAT2/SGPIO10)* 62(P1_15/GPIO0[2]/U2_TXD/SGPIO2/ENET_RXD0/T0_MAT1)* 63(P5_6/GPIO2[15]/MCOB1/EMC_D10/U1_TXD/T1_MAT2)* 64(P1_16/GPIO0[3]/U2_RXD/SGPIO3/ENET_CRS/T0_MAT0/ENET_RX_DV)* 65(P5_7/GPIO2[7]/MCOA2/EMC_D11/U1_RXD/T1_MAT3)* 66(P1_17/GPIO0[12]/U2_UCLK/ENET_MDIO/T0_CAP3/CAN1_TD/SGPIO11)* 67(P1_18/GPIO0[13]/U2_DIR/ENET_TXD0/T0_MAT3/CAN1_RD/SGPIO12)* 68(P1_19/ENET_TX_CLK(ENET_REF_CLK)/SSP1_SCK/CLKOUT/I2S0_RX_MCLK/I2S1_TX_SCK)* 69(P9_5/MCOA1/USB1_PPWR/GPIO5[18]/ENET_TXD3/SGPIO3/U0_TXD)* 70(P1_20/GPIO0[15]/SSP1_SSEL/ENET_TXD1/T0_CAP2/SGPIO13)* 91(P2_5/SGPIO14/CTIN_2/USB1_VBUS/ADCTRIG1/GPIO5[5]/T3_MAT2/USB0_IND0)* 115(P7_2/GPIO3[10]/CTIN_4/I2S0_TX_SDA/U2_RXD/SGPIO6)* 117(P7_3/GPIO3[11]/CTIN_3)* 121(P3_5/GPIO1[15]/SPIFI_SIO2/U1_RXD/I2S0_TX_SDA/I2S1_RX_WS)* 122(P3_6/GPIO0[6]/SPI_MISO/SSP0_SSEL/SPIFI_MISO/SSP0_MISO)* 123(P3_7/SPI_MOSI/SSP0_MISO/SPIFI_MOSI/GPIO5[10]/SSP0_MOSI)* 124(P3_8/SPI_SSEL/SSP0_MOSI/SPIFI_CS/GPIO5[11]/SSP0_SSEL)* 132(P7_4/GPIO3[12]/CTOUT_13/TRACEDATA[0]/ADC0_4)* 133(P7_5/GPIO3[13]/CTOUT_12/TRACEDATA[1]/ADC0_3)* 134(P7_6/GPIO3[14]/CTOUT_11/TRACEDATA[2])* 140(P7_7/GPIO3[15]/CTOUT_8/TRACEDATA[3]/ENET_MDC/SGPIO7/ADC1_6)*

### Notes on the sheet
- Micro SD Card Socket
- (near R12) Reset
- (near C27) JTAG Interface Test Reset
- (near C28) Debug Enable
- Clock Cyrstal Oscillator
- ADC Supply
- RTC Oscillator
- LPC4337 Bypass Power Bypass

### Library data of the parts
C24 C25 C27-C49 C71 = Cap Semi: Capacitor (Semiconductor SIM Model); Published: 8-Jun-2000; LatestRevisionDate: 29-May-2009; LatestRevisionNote: IPC-7351 Footprint Added.; PackageReference: C1206; Publisher: Altium Limited; PackageDescription: Chip Capacitor
DBGEN1 TRST1 = Header 2: Header, 2-Pin; LatestRevisionDate: 17-Jul-2002; LatestRevisionNote: Re-released for DXP Platform.; Publisher: Altium Limited
R8 R12-R18 R23-R26 R28 R30 R40-R45 = Res3: Resistor; Published: 8-Jun-2000; LatestRevisionDate: 29-May-2009; LatestRevisionNote: IPC-7351 Footprint Added.; PackageReference: J1-0603; Publisher: Altium Limited; PackageDescription: Chip Resistor
SD1 = JAE SJ107021 microSD Card Socket
STATUS USER_STATUS = RGB LED APTF1616SEEZGQBDC: RGB LED
U5 = LPC4330FBD144: 32-bit ARM Cortex-M4 MCU, 264 kB SRAM, 2 HS USB with on-chip PHY, Ethernet, CAN, AES, SPIFI, SGPIO, SCT, 144-Pin LQFP; fmax: 204 MHz; GPIOs: 83; SRAM: 264 kB; ROM: 64 kB; Ethernet: Y; USB: 2; ADC channels: 8; SPI: 1; UART: 4; VDD (min): 2.2 V; VDD (max): 3.6 V; Code_IEC: 136E23; DatasheetVersion: Rev.3.1, Jan-2012; PackageVersion: Feb-2003; PackageReference: SOT486-1; PackageDescription: LQFP144: Plastic Low Profile Quad Flat Package; 144 Leads; Body 20 x 20 x 1.4 mm; PWM: Y; PLL: Y; I2C: 2; CAN: 2; Timers: 4; Code_JEDEC: MS-026; ComponentLink1Description: Manufacturer URL; ComponentLink1URL: http://www.nxp.com/; ComponentLink2Description: Datasheet; ComponentLink2URL: http://www.nxp.com/documents/data_sheet/LPC4350_30_20_10.pdf
X2 = ABS07-32.768KHZ-T: ABS07-32.768KHZ-T RTC Crystal Oscillator
RTCALARM1 WAKEUP1 = Socket: LatestRevisionDate: 17-Jul-2002; LatestRevisionNote: Re-released for DXP Platform.; Publisher: Altium Limited

## Sheet Mako DSP USBR1.2.SchDoc
size A
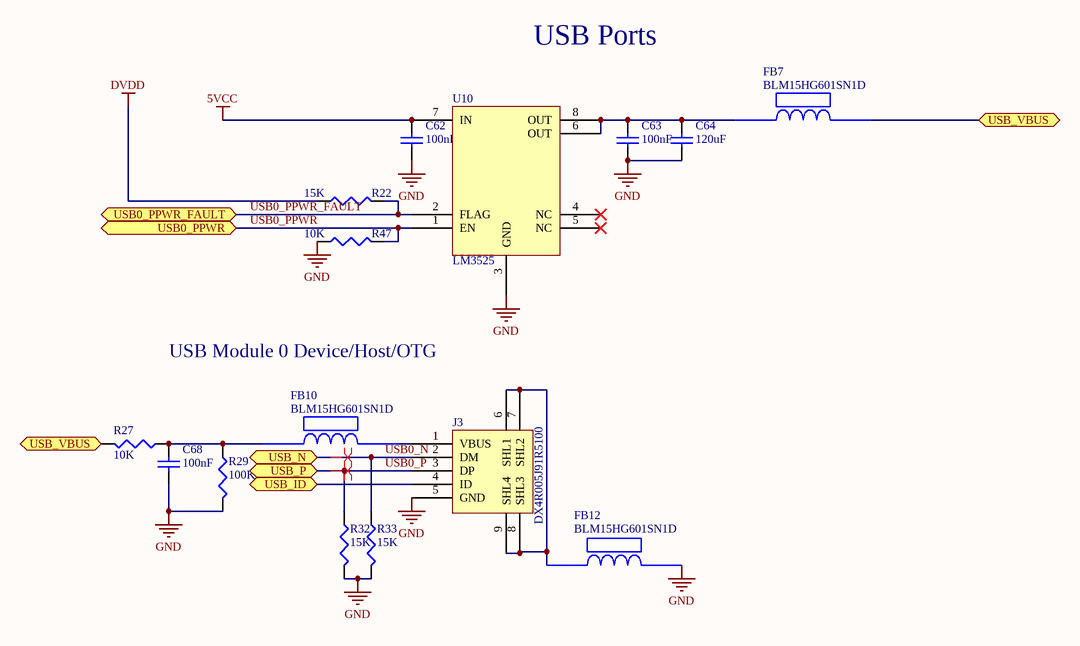
[diagram p3: Mako DSP USBR1.2.SchDoc]

### Parts
C62  value 100nF  [1608[0603]]  (hidden comment: Cap Semi)
C63  value 100nF  [1608[0603]]  (hidden comment: Cap Semi)
C64  value 120uF  [1608[0603]]  (hidden comment: Cap Semi)
C68  value 100nF  [1608[0603]]  (hidden comment: Cap Semi)
FB7  BLM15HG601SN1D  [BLM18PG121SN1D]
FB10  BLM15HG601SN1D  [BLM18PG121SN1D]
FB12  BLM15HG601SN1D  [BLM18PG121SN1D]
J3  DX4R005J91R5100  [Micro USB Circular Holes Only]
R22  value 15K  [J1-0603]  (hidden comment: Res3)
R27  value 10K  [J1-0603]  (hidden comment: Res3)
R29  value 100K  [J1-0603]  (hidden comment: Res3)
R32  value 15K  [J1-0603]  (hidden comment: Res3)
R33  value 15K  [J1-0603]  (hidden comment: Res3)
R47  value 10K  [J1-0603]  (hidden comment: Res3)
U10  LM3525  [LM3525]

### Ports
USB0_PPWR (bidir), USB0_PPWR_FAULT (bidir), USB_ID (bidir), USB_N (bidir), USB_P (bidir), USB_VBUS (bidir)

### Nets
5VCC: C62.2 U10.7(IN)
DVDD: R22.1
GND: C62.1 C63.1 C64.1 C68.1 FB12.2 J3.5(GND) R29.2 R32.2 R33.2 R47.1 U10.3(GND)
USB0_N: J3.2(DM) R33.1 ; port USB_N
USB0_P: J3.3(DP) R32.1 ; port USB_P
USB0_PPWR: R47.2 U10.1(EN) ; port USB0_PPWR
USB0_PPWR_FAULT: R22.2 U10.2(FLAG) ; port USB0_PPWR_FAULT
NetC63_2: C63.2 C64.2 FB7.1 U10.6(OUT) U10.8(OUT)
NetC68_2: C68.2 FB10.1 R27.1 R29.1
NetFB7_2: FB7.2 R27.2 ; port USB_VBUS
NetFB10_2: FB10.2 J3.1(VBUS)
NetFB12_1: FB12.1 J3.6(SHL1) J3.7(SHL2) J3.8(SHL3) J3.9(SHL4)
NetJ3_4: J3.4(ID) ; port USB_ID

Not connected (* = marked no-connect by the designer): U10 4(NC)* 5(NC)*

### Layout directives
differential pair: USB0_N, USB0_P

### Notes on the sheet
- USB Ports
- USB Module 0 Device/Host/OTG

### Library data of the parts
C62-C64 C68 = Cap Semi: Capacitor (Semiconductor SIM Model); Published: 8-Jun-2000; LatestRevisionDate: 29-May-2009; LatestRevisionNote: IPC-7351 Footprint Added.; PackageReference: C1206; Publisher: Altium Limited; PackageDescription: Chip Capacitor
J3 = Micro USB: Micro USB Jack B
R22 R27 R29 R32 R33 R47 = Res3: Resistor; Published: 8-Jun-2000; LatestRevisionDate: 29-May-2009; LatestRevisionNote: IPC-7351 Footprint Added.; PackageReference: J1-0603; Publisher: Altium Limited; PackageDescription: Chip Resistor

## Nets that join several sheets
5VCC: Mako DSP Power R1.3 (15 pins), Mako DSP USBR1.2 (C62.2 U10.7)
AVDD: Mako DSP Power R1.3 (C57.1 C58.1 U7.3), Mako DSP Audio Codec R1.2 (5 pins), Mako DSP Main R1.2 (FB5.1)
DVDD: Mako DSP Power R1.3 (6 pins), Mako DSP Audio Codec R1.2 (7 pins), Mako DSP Main R1.2 (45 pins), Mako DSP USBR1.2 (R22.1)
GND: Mako DSP Power R1.3 (40 pins), Mako DSP Audio Codec R1.2 (24 pins), Mako DSP Main R1.2 (47 pins), Mako DSP USBR1.2 (11 pins)
ADC_RX_MCLK: Mako DSP Audio Codec R1.2 (U4.9), Mako DSP Main R1.2 (U5.112)
ADC_RX_SCK: Mako DSP Audio Codec R1.2 (U4.8), Mako DSP Main R1.2 (U5.120)
ADC_RX_SDA: Mako DSP Audio Codec R1.2 (U4.10), Mako DSP Main R1.2 (U5.116)
ADC_RX_WS: Mako DSP Audio Codec R1.2 (U4.11), Mako DSP Main R1.2 (U5.114)
DAC_TX_MLCK: Mako DSP Audio Codec R1.2 (U4.5), Mako DSP Main R1.2 (U5.118)
DAC_TX_SCK: Mako DSP Audio Codec R1.2 (U4.4), Mako DSP Main R1.2 (U5.14)
DAC_TX_SDA: Mako DSP Audio Codec R1.2 (U4.6), Mako DSP Main R1.2 (U5.119)
DAC_TX_WS: Mako DSP Audio Codec R1.2 (U4.7), Mako DSP Main R1.2 (U5.113)
I2C_CLK: Mako DSP Audio Codec R1.2 (R1.1 U4.17), Mako DSP Main R1.2 (U5.88)
I2C_Data: Mako DSP Audio Codec R1.2 (R2.1 U4.16), Mako DSP Main R1.2 (U5.87)
Latch_Enable: Mako DSP Audio Codec R1.2 (U4.15), Mako DSP Main R1.2 (U5.86)
MODE: Mako DSP Audio Codec R1.2 (U4.14), Mako DSP Main R1.2 (U5.110)
NetFB7_2: Mako DSP Power R1.3 (Q1.3), Mako DSP Main R1.2 (U5.21), Mako DSP USBR1.2 (FB7.2 R27.2)
NetJ3_4: Mako DSP Main R1.2 (U5.22), Mako DSP USBR1.2 (J3.4)
USB0_N: Mako DSP Main R1.2 (U5.20), Mako DSP USBR1.2 (J3.2 R33.1)
USB0_P: Mako DSP Main R1.2 (U5.18), Mako DSP USBR1.2 (J3.3 R32.1)
USB0_PPWR: Mako DSP Main R1.2 (U5.79), Mako DSP USBR1.2 (R47.2 U10.1)
USB0_PPWR_FAULT: Mako DSP Main R1.2 (U5.83), Mako DSP USBR1.2 (R22.2 U10.2)